# Altium schematic sheet TopLevel.SchDoc
size A4
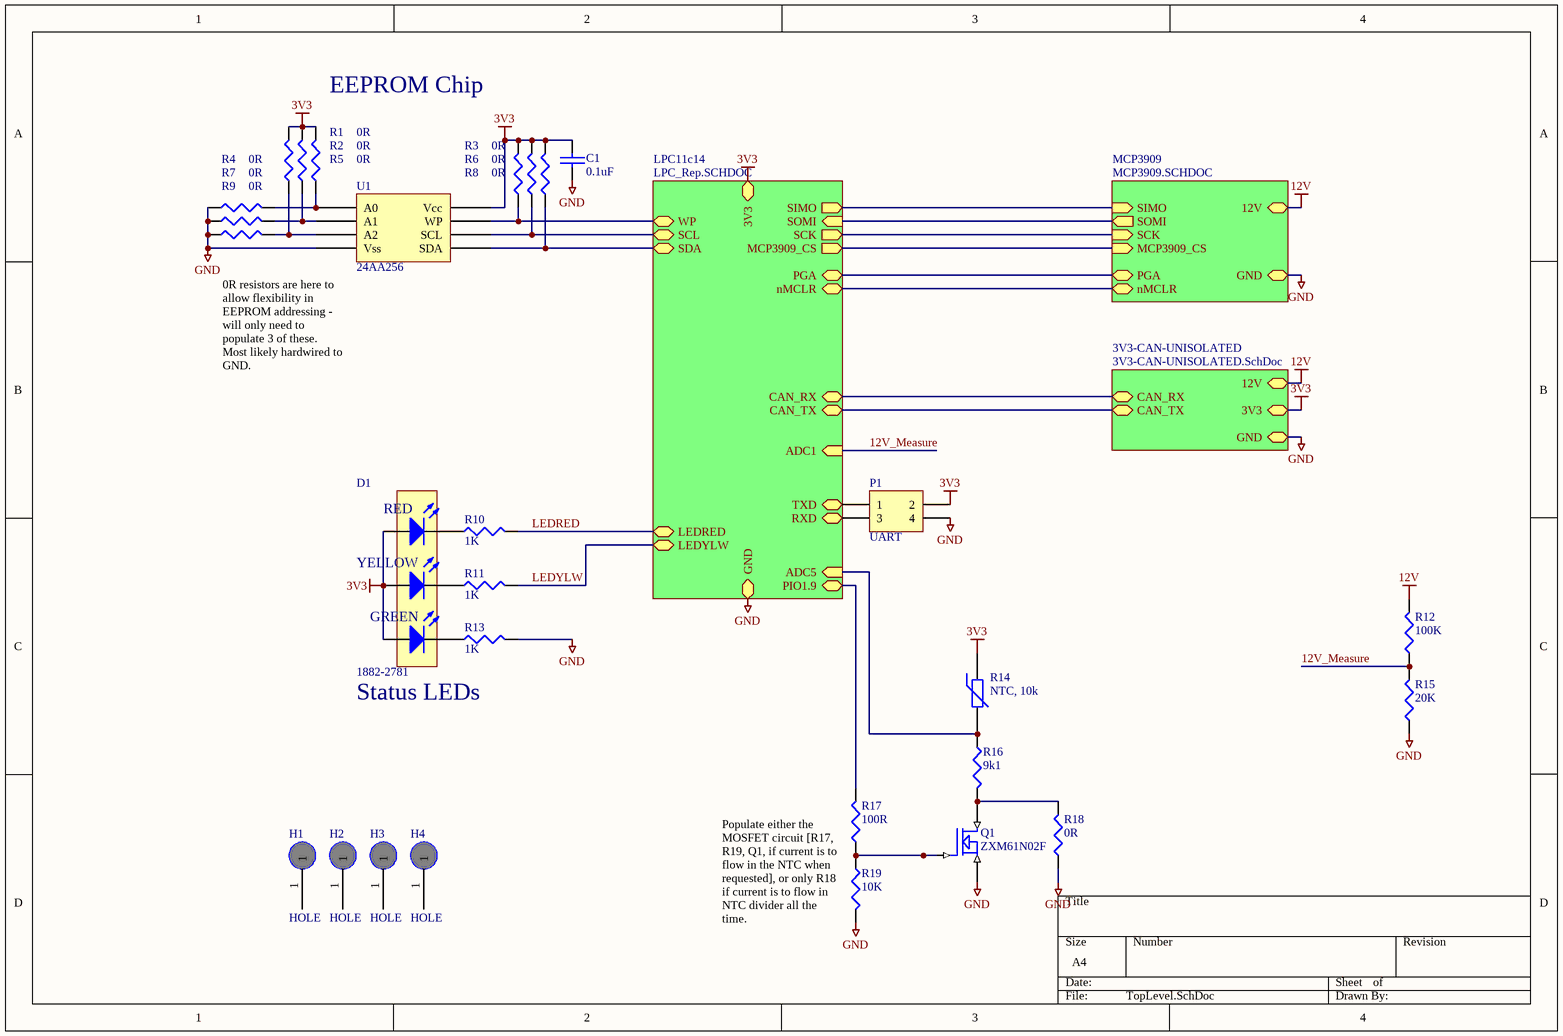
[diagram p0: TopLevel.SchDoc]

## Parts
C1  0.1uF  [0805]
D1  1882-2781  [LED_TRILEVEL]
H1  HOLE  [M2.5]
H2  HOLE  [M2.5]
H3  HOLE  [M2.5]
H4  HOLE  [M2.5]
P1  UART  [HDR2X2]
Q1  ZXM61N02F  [SOT23-3]
R1  0R  [0603]
R2  0R  [0603]
R3  0R  [0603]
R4  0R  [0603]
R5  0R  [0603]
R6  0R  [0603]
R7  0R  [0603]
R8  0R  [0603]
R9  0R  [0603]
R10  1K  [0603]
R11  1K  [0603]
R12  100K  [1206]
R13  1K  [0603]
R14  NTC, 10k  [NTC_EPCOS]
R15  20K  [1206]
R16  9k1  [0603]
R17  100R  [0603]
R18  0R  [0603]
R19  10K  [0603]
U1  24AA256  [DIP8]

## Sub-sheets
3V3-CAN-UNISOLATED = 3V3-CAN-UNISOLATED.SchDoc: CAN_RX, CAN_TX, GND, 12V, 3V3
LPC11c14 = LPC_Rep.SCHDOC: SIMO (out), SOMI (in), SCK (out), MCP3909_CS (out), PGA, nMCLR, CAN_RX, CAN_TX, 3V3, GND, SCL, SDA, WP, LEDRED, LEDYLW, ADC5 (in), PIO1.9, ADC1 (in), TXD, RXD
MCP3909 = MCP3909.SCHDOC: SIMO (in), SOMI (out), SCK (in), MCP3909_CS (in), PGA, nMCLR, 12V, GND

## Nets
3V3: C1.1 D1.4(A) D1.5(A) D1.6(A) P1.2 R1.2 R2.2 R3.2 R5.2 R6.2 R8.2 R14.1 U1.8(Vcc) ; sheet LPC11c14/3V3, sheet 3V3-CAN-UNISOLATED/3V3
12V: R12.2 ; sheet MCP3909/12V, sheet 3V3-CAN-UNISOLATED/12V
GND: C1.2 P1.4 Q1.2(S) R4.1 R7.1 R9.1 R13.2 R15.1 R18.1 R19.2 U1.4(Vss) ; sheet LPC11c14/GND, sheet MCP3909/GND, sheet 3V3-CAN-UNISOLATED/GND
12V_Measure: R12.1 R15.2 ; sheet LPC11c14/ADC1
LEDRED: R10.2 ; sheet LPC11c14/LEDRED
LEDYLW: R11.2 ; sheet LPC11c14/LEDYLW
NetD1_1: D1.1(K) R13.1
NetD1_2: D1.2(K) R11.1
NetD1_3: D1.3(K) R10.1
NetP1_1: P1.1 ; sheet LPC11c14/TXD
NetP1_3: P1.3 ; sheet LPC11c14/RXD
NetQ1_1: Q1.1(G) R17.1 R19.1
NetQ1_3: Q1.3(D) R16.2 R18.2
NetR1_1: R1.1 R4.2 U1.1(A0)
NetR2_1: R2.1 R7.2 U1.2(A1)
NetR3_1: R3.1 U1.5(SDA) ; sheet LPC11c14/SDA
NetR5_1: R5.1 R9.2 U1.3(A2)
NetR6_1: R6.1 U1.6(SCL) ; sheet LPC11c14/SCL
NetR8_1: R8.1 U1.7(WP) ; sheet LPC11c14/WP
NetR14_2: R14.2 R16.1 ; sheet LPC11c14/ADC5
NetR17_2: R17.2 ; sheet LPC11c14/PIO1.9
(unnamed): sheet LPC11c14/SIMO, sheet MCP3909/SIMO
(unnamed): sheet LPC11c14/SOMI, sheet MCP3909/SOMI
(unnamed): sheet LPC11c14/SCK, sheet MCP3909/SCK
(unnamed): sheet LPC11c14/MCP3909_CS, sheet MCP3909/MCP3909_CS
(unnamed): sheet LPC11c14/PGA, sheet MCP3909/PGA
(unnamed): sheet LPC11c14/nMCLR, sheet MCP3909/nMCLR
(unnamed): sheet LPC11c14/CAN_RX, sheet 3V3-CAN-UNISOLATED/CAN_RX
(unnamed): sheet LPC11c14/CAN_TX, sheet 3V3-CAN-UNISOLATED/CAN_TX

Not connected (* = marked no-connect by the designer): H1 1; H2 1; H3 1; H4 1

## Notes on the sheet
- EEPROM Chip
- 0R resistors are here to allow flexibility in EEPROM addressing - will only need to populate 3 of these. Most likely hardwired to GND.
- Status LEDs
- Populate either the MOSFET circuit [R17, R19, Q1, if current is to flow in the NTC when requested], or only R18 if current is to flow in NTC divider all the time.
- (in symbol LED-TRILEVEL) RED; YELLOW; GREEN

## Library data of the parts
C1 = CAP: Capacitor; Order#: ??; Price: ??; Supplier: ??
D1 = LED-TRILEVEL: Three level LED; Farnell: 1461596
P1 = Header 2X2: Header, 2-Pin, Dual row; LatestRevisionDate: 17-Jul-2002; LatestRevisionNote: Re-released for DXP Platform.; Publisher: Altium Limited
Q1 = ZXM61N02F: 1.7A, 20V N-Channel Enhancement mode FET; Order#: 9525270; Price: 0.803; Supplier: Farnell
R1-R9 = RES1: Resistor; Order#: 933-1697; Price: 0.11; Supplier: Farnell
R10 R11 R13 = RES1: Resistor; Order#: 9331697; Supplier: Farnell; Price: 0.05
R12 R15 = RES1: Resistor; Farnell: *
R14 = Res Varistor: Varistor (Voltage-Sensitive Resistor); EPCOS: B57540G0103F00; Farnell: 1712520
R16 = RES1: Resistor; Order#: 9330380; Supplier: Farnell; Price: 0.066
R17-R19 = RES1: Resistor; Order#: 9233253; Supplier: Farnell; Price: 0.088